# Altium schematic sheet Audio.SchDoc: Audio&DFSDM
size A4; Author: P.A.; CompanyName: STMicroelectronics; Organization: Microcontrollers Division; Address1: 12, Rue Jules HOROWITZ; Address2: 38019 Grenoble; Address3: FRANCE; DocumentNumber: MB1261; Revision: B.01; SheetNumber: 15; SheetTotal: 15; Project: STM32L496G-DISCO
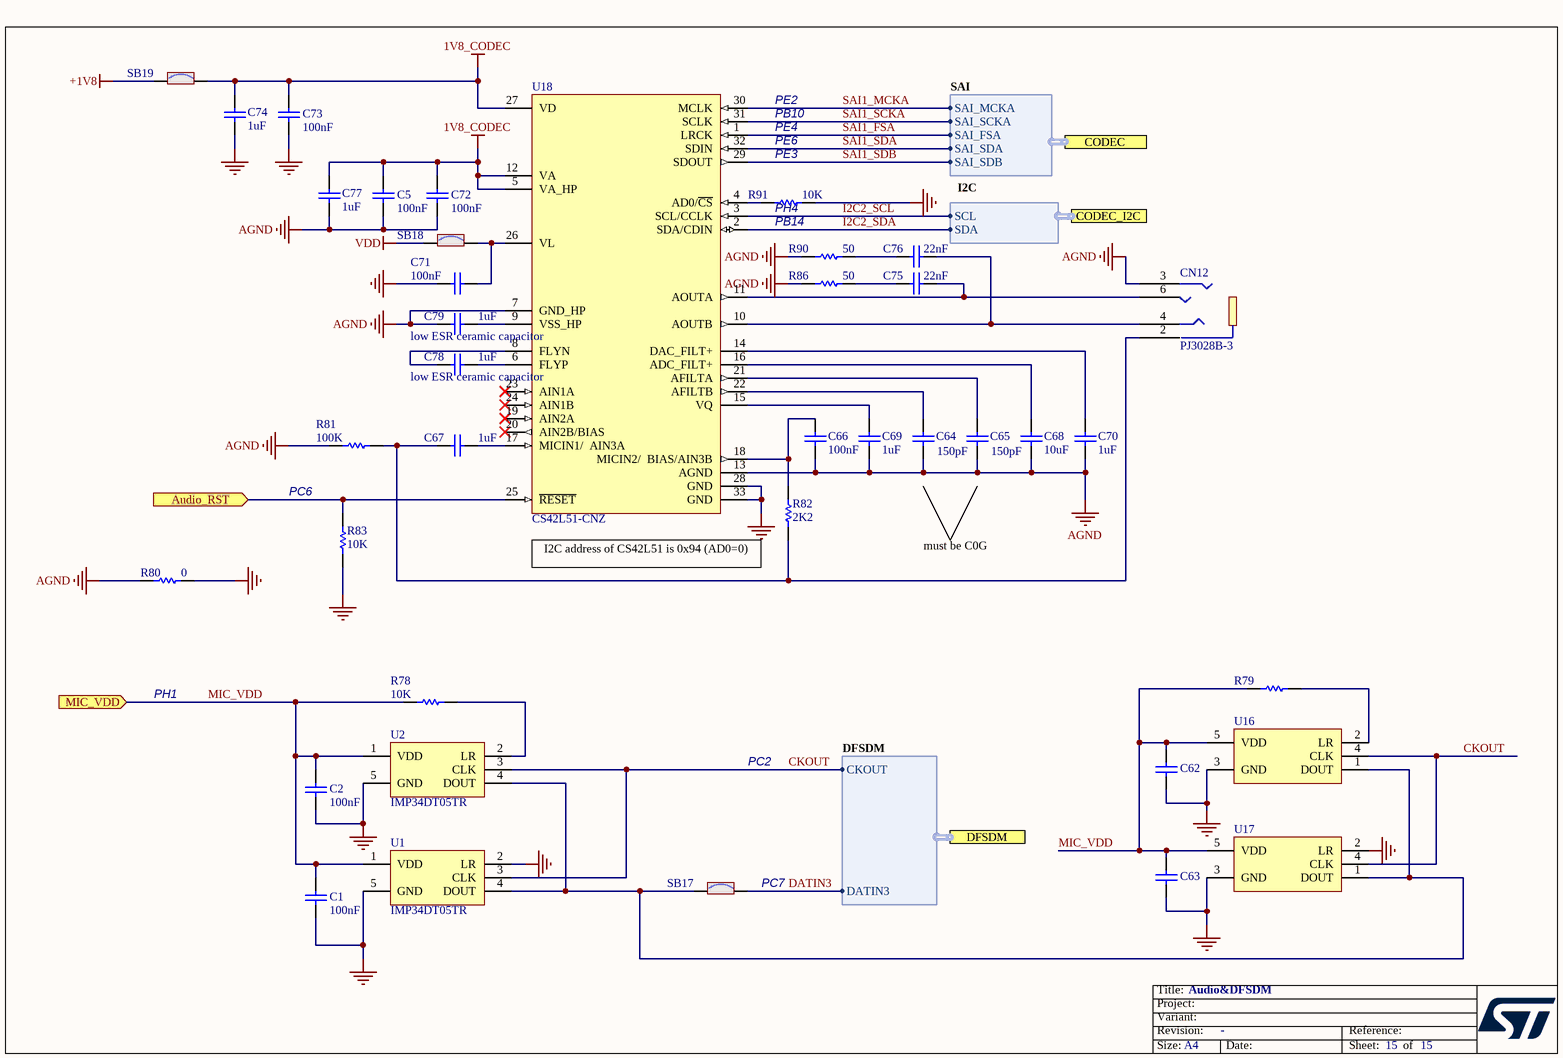
[diagram p0: Audio.SchDoc]

## Parts
C1  value 100nF  [0603C]  (hidden comment: CC0603KRX7R7BB104)
C2  value 100nF  [0603C]  (hidden comment: CC0603KRX7R7BB104)
C5  value 100nF  [0603C]  (hidden comment: CC0603KRX7R7BB104)
C62  (no value)  [0603C]
C63  (no value)  [0603C]
C64  value 150pF  [0603C]  (hidden comment: CC0603JRNPO9BN151)
C65  value 150pF  [0603C]  (hidden comment: CC0603JRNPO9BN151)
C66  value 100nF  [0603C]  (hidden comment: CC0603KRX7R7BB104)
C67  value 1uF  [0603C]  (hidden comment: CC0603KRX5R7BB105)
C68  value 10uF  [0603C]  (hidden comment: C1608X5R1A106K080AC)
C69  value 1uF  [0603C]  (hidden comment: CC0603KRX5R7BB105)
C70  value 1uF  [0603C]  (hidden comment: CC0603KRX5R7BB105)
C71  value 100nF  [0603C]  (hidden comment: CC0603KRX7R7BB104)
C72  value 100nF  [0603C]  (hidden comment: CC0603KRX7R7BB104)
C73  value 100nF  [0603C]  (hidden comment: CC0603KRX7R7BB104)
C74  value 1uF  [0603C]  (hidden comment: CC0603KRX5R7BB105)
C75  value 22nF  [0603C]  (hidden comment: CC0603KRX7R8BB223)
C76  value 22nF  [0603C]  (hidden comment: CC0603KRX7R8BB223)
C77  value 1uF  [0603C]  (hidden comment: CC0603KRX5R7BB105)
C78  value 1uF  [0603C]  (hidden comment: CC0603KRX5R7BB105)
C79  value 1uF  [0603C]  (hidden comment: CC0603KRX5R7BB105)
CN12  PJ3028B-3  [PJ3028B]
R78  value 10K  [0603R]  (hidden comment: RC0603FR-0710KL)
R79  (no value)  [0603R]
R80  value 0  [0603R]  (hidden comment: RC0603JR-070RL)
R81  value 100K  [0603R]  (hidden comment: RC0603FR-07100KL)
R82  value 2K2  [0603R]  (hidden comment: RC0603FR-072K2L)
R83  value 10K  [0603R]  (hidden comment: RC0603FR-0710KL)
R86  value 50  [0603R]  (hidden comment: RC0603FR-0750RL)
R90  value 50  [0603R]  (hidden comment: RC0603FR-0750RL)
R91  value 10K  [0603R]  (hidden comment: RC0603FR-0710KL)
SB17  Solder Bridge ON  [SB_0603]  (value not drawn)
SB18  Solder Bridge ON  [SB_0603]  (value not drawn)
SB19  Solder Bridge ON  [SB_0603]  (value not drawn)
U1  IMP34DT05TR  [MIC_HCLGA_3X4X1_4LD]
U2  IMP34DT05TR  [MIC_HCLGA_3X4X1_4LD]
U16  (no value)  [RHLGA5LD]
U17  (no value)  [RHLGA5LD]
U18  CS42L51-CNZ  [QFN32_0R5_5X5]

## Ports
Audio_RST (in), CODEC (harness SAI), CODEC_I2C (harness I2C), DFSDM (harness DFSDM), MIC_VDD (in)

## Harnesses
SAI: SAI_SDB, SAI_FSA, SAI_MCKA, SAI_SDA, SAI_SCKA
I2C: SDA, SCL
DFSDM: DATIN3, CKOUT

## Nets
1V8_CODEC: C5.1 C72.1 C73.1 C74.1 C77.1 SB19.2 U18.5(VA_HP) U18.12(VA) U18.27(VD)
+1V8: SB19.1
AGND: C5.2 C64.2 C65.2 C66.1 C68.1 C69.1 C70.1 C72.2 C77.2 C79.1 CN12.3 R80.2 R81.2 R86.2 R90.2 U18.7(GND_HP) U18.13(AGND)
GND: C1.2 C2.2 C62.2 C63.2 C71.1 C73.2 C74.2 R80.1 R83.1 R91.1 U1.2(LR) U1.5(GND) U2.5(GND) U16.3(GND) U17.2(LR) U17.3(GND) U18.28(GND) U18.33(GND)
VDD: SB18.1
Audio_RST: R83.2 U18.25(~{RESET}) ; port Audio_RST
CKOUT: U1.3(CLK) U2.3(CLK) U16.4(CLK) U17.4(CLK) ; port DFSDM.CKOUT
DATIN3: SB17.2 ; port DFSDM.DATIN3
I2C2_SCL: U18.3(SCL/CCLK) ; port CODEC_I2C.SCL
I2C2_SDA: U18.2(SDA/CDIN) ; port CODEC_I2C.SDA
MIC_VDD: C1.1 C2.1 C62.1 C63.1 R78.2 R79.2 U1.1(VDD) U2.1(VDD) U16.5(VDD) U17.5(VDD) ; port MIC_VDD
SAI1_FSA: U18.1(LRCK) ; port CODEC.SAI_FSA
SAI1_MCKA: U18.30(MCLK) ; port CODEC.SAI_MCKA
SAI1_SCKA: U18.31(SCLK) ; port CODEC.SAI_SCKA
SAI1_SDA: U18.32(SDIN) ; port CODEC.SAI_SDA
SAI1_SDB: U18.29(SDOUT) ; port CODEC.SAI_SDB
NetC64_1: C64.1 U18.22(AFILTB)
NetC65_1: C65.1 U18.21(AFILTA)
NetC66_2: C66.2 R82.2 U18.18(MICIN2/__BIAS/AIN3B)
NetC67_1: C67.1 CN12.2 R81.1 R82.1
NetC67_2: C67.2 U18.17(MICIN1/__AIN3A)
NetC68_2: C68.2 U18.16(ADC_FILT+)
NetC69_2: C69.2 U18.15(VQ)
NetC70_2: C70.2 U18.14(DAC_FILT+)
NetC71_2: C71.2 SB18.2 U18.26(VL)
NetC75_1: C75.1 CN12.6 U18.11(AOUTA)
NetC75_2: C75.2 R86.1
NetC76_1: C76.1 CN12.4 U18.10(AOUTB)
NetC76_2: C76.2 R90.1
NetC78_1: C78.1 U18.8(FLYN)
NetC78_2: C78.2 U18.6(FLYP)
NetC79_2: C79.2 U18.9(VSS_HP)
NetR78_1: R78.1 U2.2(LR)
NetR79_1: R79.1 U16.2(LR)
NetR91_2: R91.2 U18.4(AD0/~{CS})
NetSB17_1: SB17.1 U1.4(DOUT) U2.4(DOUT) U16.1(DOUT) U17.1(DOUT)

Not connected (* = marked no-connect by the designer): U18 19(AIN2A)* 20(AIN2B/BIAS)* 23(AIN1A)* 24(AIN1B)*

## Notes on the sheet
- PB10
- PE2
- PE4
- PE6
- PE3
- (near R91) PH4
- (near R91) PB14
- (near U18) low ESR ceramic capacitor
- PC6
- I2C address of CS42L51 is 0x94 (AD0=0)
- must be C0G
- PH1
- PC2
- (near SB17) PC7
- Title:
- Project:
- Size:
- Revision:
- Variant:
- A4
- -
- Date:
- Reference:
- Sheet:
- of

## Library data of the parts
C1 C2 C5 C66 C71-C73 = Cap: Capacitor,100nF,10%,16V,X7R,0603,YAGEO; Ordered by: Subcon; Published: 8-Jun-2000; Revision: July-2002: Re-released for DXP Platform.; Publisher: Altium Limited; Manuf_1: YAGEO; Manuf_Part_1: CC0603KRX7R7BB104
C62 C63 = Cap: Capacitor,100nF,10%,16V,X7R,0603,YAGEO; Manuf_Part_1: CC0603KRX7R7BB104; Ordered by: Subcon; Published: 8-Jun-2000; Revision: July-2002: Re-released for DXP Platform.; Publisher: Altium Limited; Value: 100nF; Manuf_1: YAGEO
C64 C65 = Cap: Capacitor,150pF,0603,50V,5%,NPO; Manuf_1: YAGEO; Ordered by: Subcon; ECCN_US/EU: NA; Published: 8-Jun-2000; Revision: July-2002: Re-released for DXP Platform.; Publisher: Altium Limited; Manuf_Part_1: CC0603JRNPO9BN151
C67 C69 C70 C74 C77-C79 = Cap: Capacitor,1uF,0603,16V,10%,X5R,YAGEO; Ordered by: Subcon; Published: 8-Jun-2000; Revision: July-2002: Re-released for DXP Platform.; Publisher: Altium Limited; Manuf_1: YAGEO; Manuf_Part_1: CC0603KRX5R7BB105
C68 = Cap: Capacitor,10uF,10%,10V,X5R,0603,C1608X5R1A106K080AC; Manuf_1: TDK; Manuf_Part_1: C1608X5R1A106KT000E; Ordered by: Subcon; ECCN_US/EU: NA; Published: 8-Jun-2000; Revision: July-2002: Re-released for DXP Platform.; Publisher: Altium Limited
C75 C76 = Cap: Capacitor,22nF,10%,25V,X7R,0603; Manuf_1: YAGEO; Ordered by: Subcon; ECCN_US/EU: NA; Published: 8-Jun-2000; Revision: July-2002: Re-released for DXP Platform.; Publisher: Altium Limited; Manuf_Part_1: CC0603KRX7R8BB223
CN12 = PJ3028B-3: Manuf_1: QIAOD; Ordered by: Subcon; Silkscreen: AUDIO_JACK; ECCN_US/EU: NA; Manuf_Part_1: PJ3028B-3
R78 R83 R91 = res1: Resistor,10K,0603,1%,YAGEO; Ordered by: Subcon; ECCN_US/EU: NA; Published: 8-Jun-2000; Revision: July-2002: Re-released for DXP Platform.; Publisher: Altium Limited; Manuf_1: YAGEO; Manuf_Part_1: RC0603FR-0710KL
R79 = res1: Resistor,10K,0603,1%,YAGEO; Manuf_Part_1: RC0603FR-0710KL; Ordered by: Subcon; ECCN_US/EU: [N/A]; Published: 8-Jun-2000; Revision: July-2002: Re-released for DXP Platform.; Publisher: Altium Limited; Value: 10K; Manuf_1: YAGEO
R80 = res1: Resistor, 0 ,0603,1%,YAGEO; Ordered by: Subcon; ECCN_US/EU: NA; Published: 8-Jun-2000; Revision: July-2002: Re-released for DXP Platform.; Publisher: Altium Limited; Manuf_1: YAGEO; Manuf_Part_1: RC0603JR-070RL
R81 = res1: Resistor,100K,0603,1%,YAGEO; Ordered by: Subcon; ECCN_US/EU: NA; Published: 8-Jun-2000; Revision: July-2002: Re-released for DXP Platform.; Publisher: Altium Limited; Manuf_1: YAGEO; Manuf_Part_1: RC0603FR-07100KL
R82 = res1: Resistor,2.2K,0603,1%,YAGEO; Ordered by: Subcon; ECCN_US/EU: NA; Published: 8-Jun-2000; Revision: July-2002: Re-released for DXP Platform.; Publisher: Altium Limited; Manuf_1: YAGEO; Manuf_Part_1: RC0603FR-072K2L
R86 R90 = res1: Resistor,50R,0603,1%,YAGEO; Ordered by: Subcon; ECCN_US/EU: NA; Published: 8-Jun-2000; Revision: July-2002: Re-released for DXP Platform.; Publisher: Altium Limited; Manuf_1: YAGEO; Manuf_Part_1: RC0603FR-0750RL
SB17-SB19 = SB_ON: Manuf_1: YAGEO; Manuf_Part_1: RC0603JR-070RL; Solder: YES; Ordered By: Subcon; Revision: July-2002: Re-released for DXP Platform.; ECCN_US/EU: N/A
U1 U2 = MCD-01715: MEMS audio sensor omnidirectional digital microphone for industrial applications; BMS_Part_Number: 9177995; Part_Type: IC; Part_Preference: Recommended; Manufacturer: STMICROELECTRONICS; Manufacturer_HQ_COO: EU; Component_Country_Of_Origin: Philippines; Internal_Part_Number: MCD-01715; Value: IMP34DT05TR; Status: Released; Manufacturer_Part_Number: IMP34DT05TR; Package: HCLGA-4LD; ComponentLink1URL: http://tunmcdsvn.tun.st.com/Component_Datasheet_Library/Trunk/IC/STM_Digital-Microphone_IMP34DT05TR
U16 U17 = MP23DB01MM: MEMS micro; Manuf_1: STM; ECCN_US/EU: EAR99/NEC; Ref St: 9188010; Fitted: NO; Publisher: STM; Manuf_Part_1: MP23DB01MM; Ordered by: STM
U18 = CS42L51-CNZ: Low-Power, Stereo Codec with Headphone Amp; Manuf_1: Cirrus; Ordered by: Subcon; Manuf_Part_1: CS42L51-CNZ